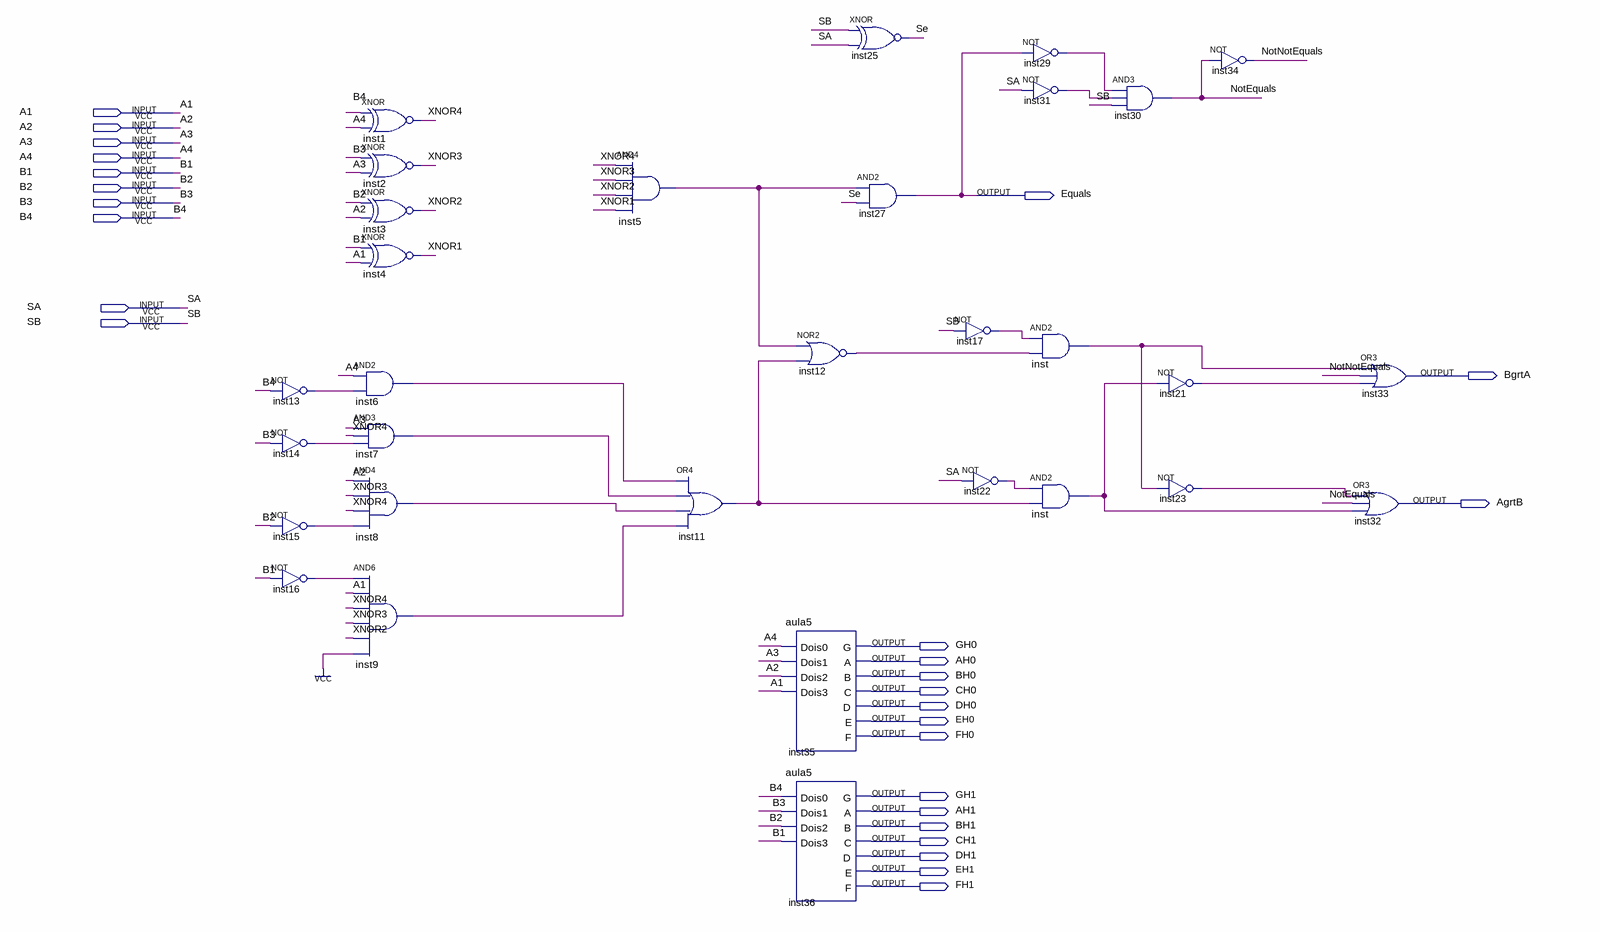
[diagram p0: schematic sheet]
// Quartus schematic Comparador.bdf as structural Verilog: 31 symbols, 27 pins
module Comparador (
  input  A1,
  input  A2,
  input  A3,
  input  A4,
  input  B1,
  input  B2,
  input  B3,
  input  B4,
  input  SA,
  input  SB,
  output Equals,
  output BgrtA,
  output AgrtB,
  output GH0,
  output AH0,
  output BH0,
  output CH0,
  output DH0,
  output EH0,
  output FH0,
  output GH1,
  output AH1,
  output BH1,
  output CH1,
  output DH1,
  output EH1,
  output FH1
);

  wire inst5_out, inst6_out, inst7_out, inst8_out, inst9_out, inst11_out, inst12_out, inst13_out, inst14_out,
       inst15_out, inst16_out, inst17_out, inst21_out, inst22_out, inst23_out, inst29_out, inst31_out,
       inst_out, inst_out_2, NotEquals, NotNotEquals, Se, XNOR1, XNOR2, XNOR3, XNOR4;

  not inst13 (inst13_out, B4);
  not inst14 (inst14_out, B3);
  not inst15 (inst15_out, B2);
  not inst16 (inst16_out, B1);
  and inst6 (inst6_out, A4, inst13_out);
  and inst7 (inst7_out, A3, XNOR4, inst14_out);
  and inst8 (inst8_out, A2, XNOR3, XNOR4, inst15_out);
  and inst9 (inst9_out, inst16_out, A1, XNOR4, XNOR3, XNOR2, 1'b1);
  xnor inst1 (XNOR4, B4, A4);
  xnor inst2 (XNOR3, B3, A3);
  xnor inst3 (XNOR2, B2, A2);
  xnor inst4 (XNOR1, B1, A1);
  and inst5 (inst5_out, XNOR4, XNOR3, XNOR2, XNOR1);
  or inst11 (inst11_out, inst6_out, inst7_out, inst8_out, inst9_out);
  nor inst12 (inst12_out, inst5_out, inst11_out);
  aula5 inst35 (
    .Dois0(A4), .Dois1(A3), .Dois2(A2), .Dois3(A1), .G(GH0), .A(AH0), .B(BH0), .C(CH0), .D(DH0), .E(EH0),
    .F(FH0));
  aula5 inst36 (
    .Dois0(B4), .Dois1(B3), .Dois2(B2), .Dois3(B1), .G(GH1), .A(AH1), .B(BH1), .C(CH1), .D(DH1), .E(EH1),
    .F(FH1));
  xnor inst25 (Se, SB, SA);
  and inst27 (Equals, inst5_out, Se);
  not inst17 (inst17_out, SB);
  not inst22 (inst22_out, SA);
  not inst29 (inst29_out, Equals);
  not inst31 (inst31_out, SA);
  and inst (inst_out_2, inst17_out, inst12_out);
  and inst_dup2 (inst_out, inst22_out, inst11_out);
  and inst30 (NotEquals, inst29_out, inst31_out, SB);
  not inst21 (inst21_out, inst_out);
  not inst23 (inst23_out, inst_out_2);
  not inst34 (NotNotEquals, NotEquals);
  or inst33 (BgrtA, inst_out_2, NotNotEquals, inst21_out);
  or inst32 (AgrtB, inst23_out, NotEquals, inst_out);
endmodule
